# Altium schematic sheet Power Distribution - Power Path 2 Parallel MOSFET.SchDoc: Title
size B; Organization: Midnight Sun Solar Rayce Car Team; Address1: University of Waterloo; Address2: 200 University Ave W; Address3: Waterloo, ON, Canada; Address4: N2L 3E9; Website: www.uwmidsun.com; ProjectName: ProjectName
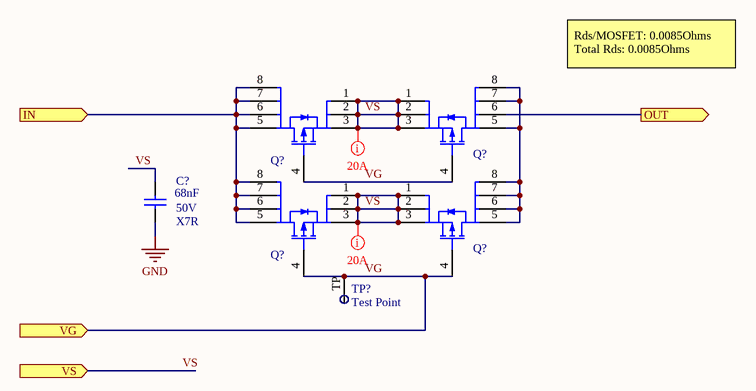
[diagram p0: Power Distribution - Power Path 2 Parallel MOSFET.SchDoc]

## Parts
(Parts that share a designator on the sheet are numbered #1, #2 ... from top to bottom, then left to right.)
C?  68nF  Voltage Rating: 50V  Dielectric: X7R  [CAP, 0603]
Q?#1  MOSFET P-CH PWR56 40V 4.9 MOHM  [PMOS PWR56 40V 4.9 MOHM]  (value not drawn)
Q?#2  MOSFET P-CH PWR56 40V 4.9 MOHM  [PMOS PWR56 40V 4.9 MOHM]  (value not drawn)
Q?#3  MOSFET P-CH PWR56 40V 4.9 MOHM  [PMOS PWR56 40V 4.9 MOHM]  (value not drawn)
Q?#4  MOSFET P-CH PWR56 40V 4.9 MOHM  [PMOS PWR56 40V 4.9 MOHM]  (value not drawn)
TP?  Test Point  [Test Point]  (no BOM)

## Ports
IN (in), OUT (out), VG (in), VS (in)

## Nets
GND: C?.2
IN: Q?#1.5(D) Q?#1.6(D) Q?#1.7(D) Q?#1.8(D) Q?#3.5(D) Q?#3.6(D) Q?#3.7(D) Q?#3.8(D) ; port IN
OUT: Q?#2.6(D) ; port OUT
VG: Q?#1.4(G) Q?#2.4(G) Q?#3.4(G) Q?#4.4(G) TP?.TP ; port VG
VS: C?.1 Q?#1.1(S) Q?#1.2(S) Q?#1.3(S) Q?#2.1(S) Q?#2.2(S) Q?#2.3(S) Q?#3.1(S) Q?#3.2(S) Q?#3.3(S) Q?#4.1(S) Q?#4.2(S) Q?#4.3(S) ; port VS
NetQ?#2_5: Q?#2.5(D) Q?#2.7(D) Q?#2.8(D) Q?#4.5(D) Q?#4.6(D) Q?#4.7(D) Q?#4.8(D)

## Layout directives
net class HighCurrent; rule Power Plane Connect Style [Style - Direct Connect]; rule Polygon Connect Style [Style - Direct Connect]: VS

## Notes on the sheet
- Rds/MOSFET: 0.0085Ohms
  Total Rds: 0.0085Ohms
- PROJECT
- DOCUMENT
- DRAWN BY
- LAST MODIFIED
- PART NUMBER
- REVISION
- SHEET
- VARIANT
- OF
- Engineering 5 - 1002
  University of Waterloo
  (519) 888-4567 x32978
  hardware@uwmidsun.com

## Library data of the parts
C? = CAP CER 0.068UF 10% 50V X7R 0603: 0.068µF 50V Ceramic Capacitor X7R 0603 (1608 Metric) 0.063" L x 0.032" W (1.60mm x 0.80mm); Manufacturer: Murata; Manufacturer Part Number: GCM188R71H683KA57D; Tolerance: 10%; Supplier 1: Digi-Key; Stock 1: 40000; Pricing 1: 1=0.16, 10=0.116, 100=0.0547, 500=0.03832, 1000=0.03172 (USD); Mount: Surface Mount; Case/Package: 0603; Case Code (Metric): 1608; Case Code (Imperial): 0603; Min Operating Temperature: -55°C; Max Operating Temperature: 125°C; Packaging: Tape and Reel; Capacitance: 68nF; Package Quantity: 4000; Voltage Rating (DC): 50V; Termination: SMD/SMT; Length: 1.6mm; Height: 0.8mm; Width: 0.031inch; Thickness: 0.035inch; Depth: 0.8mm; Radiation Hardening: No; ComponentLink1URL: https://datasheet.ciiva.com/29542/s0717e-29542427.pdf; ComponentLink1Description: https://datasheet.ciiva.com/29542/s0717e-29542427.pdf; ComponentLink2URL: https://datasheet.ciiva.com/29542/s0717e-29542428.pdf; ComponentLink2Description: https://datasheet.ciiva.com/29542/s0717e-29542428.pdf; ComponentLink3URL: https://datasheet.ciiva.com/29542/s0717e-29542429.pdf; ComponentLink3Description: https://datasheet.ciiva.com/29542/s0717e-29542429.pdf; Supplier Part Number 1: 490-8027-1-ND
Q?#1-Q?#4 = MOSFET P-CH PWR56 40V 4.9 MOHM: P-Channel 16V 2.5A (Ta) 650mW (Ta) Surface Mount X2-DFN2015-3; Current - Continuous Drain (Id) @ 25°C: 80A (Tc); Drive Voltage (Max Rds On,  Min Rds On): 4.5V, 10V; Vgs(th) (Max) @ Id: 3V @ 250µA; Gate Charge (Qg) (Max) @ Vgs: 107nC @ 10V; Input Capacitance (Ciss) (Max) @ Vds: 4840pF @ 20V; Power Dissipation (Max): 214W (Tj); Rds On (Max) @ Id, Vgs: 4.9mOhm @ 80A, 10V; Packaging: Cut Tape (CT); Part Status: Active; FET Type: P-Channel; Technology: MOSFET (Metal Oxide); Drain to Source Voltage (Vdss): 40V; Vgs (Max): ±16V; FET Feature: -; Operating Temperature: -55°C ~ 175°C (TJ); Mounting Type: Surface Mount; Supplier Device Package: FDWS9508L-F085OSCT-ND; Package / Case: 8-PowerTDFN; ComponentLink1URL: https://www.onsemi.com/pub/Collateral/FDWS9508L-F085-D.PDF; ComponentLink1Description: https://www.onsemi.com/pub/Collateral/FDWS9508L-F085-D.PDF; Supplier 1: Digi-Key; Supplier Part Number 1: FDWS9508L-F085OSCT-ND